# EAGLE design main_flight_computer (EAGLE 9.6.2)
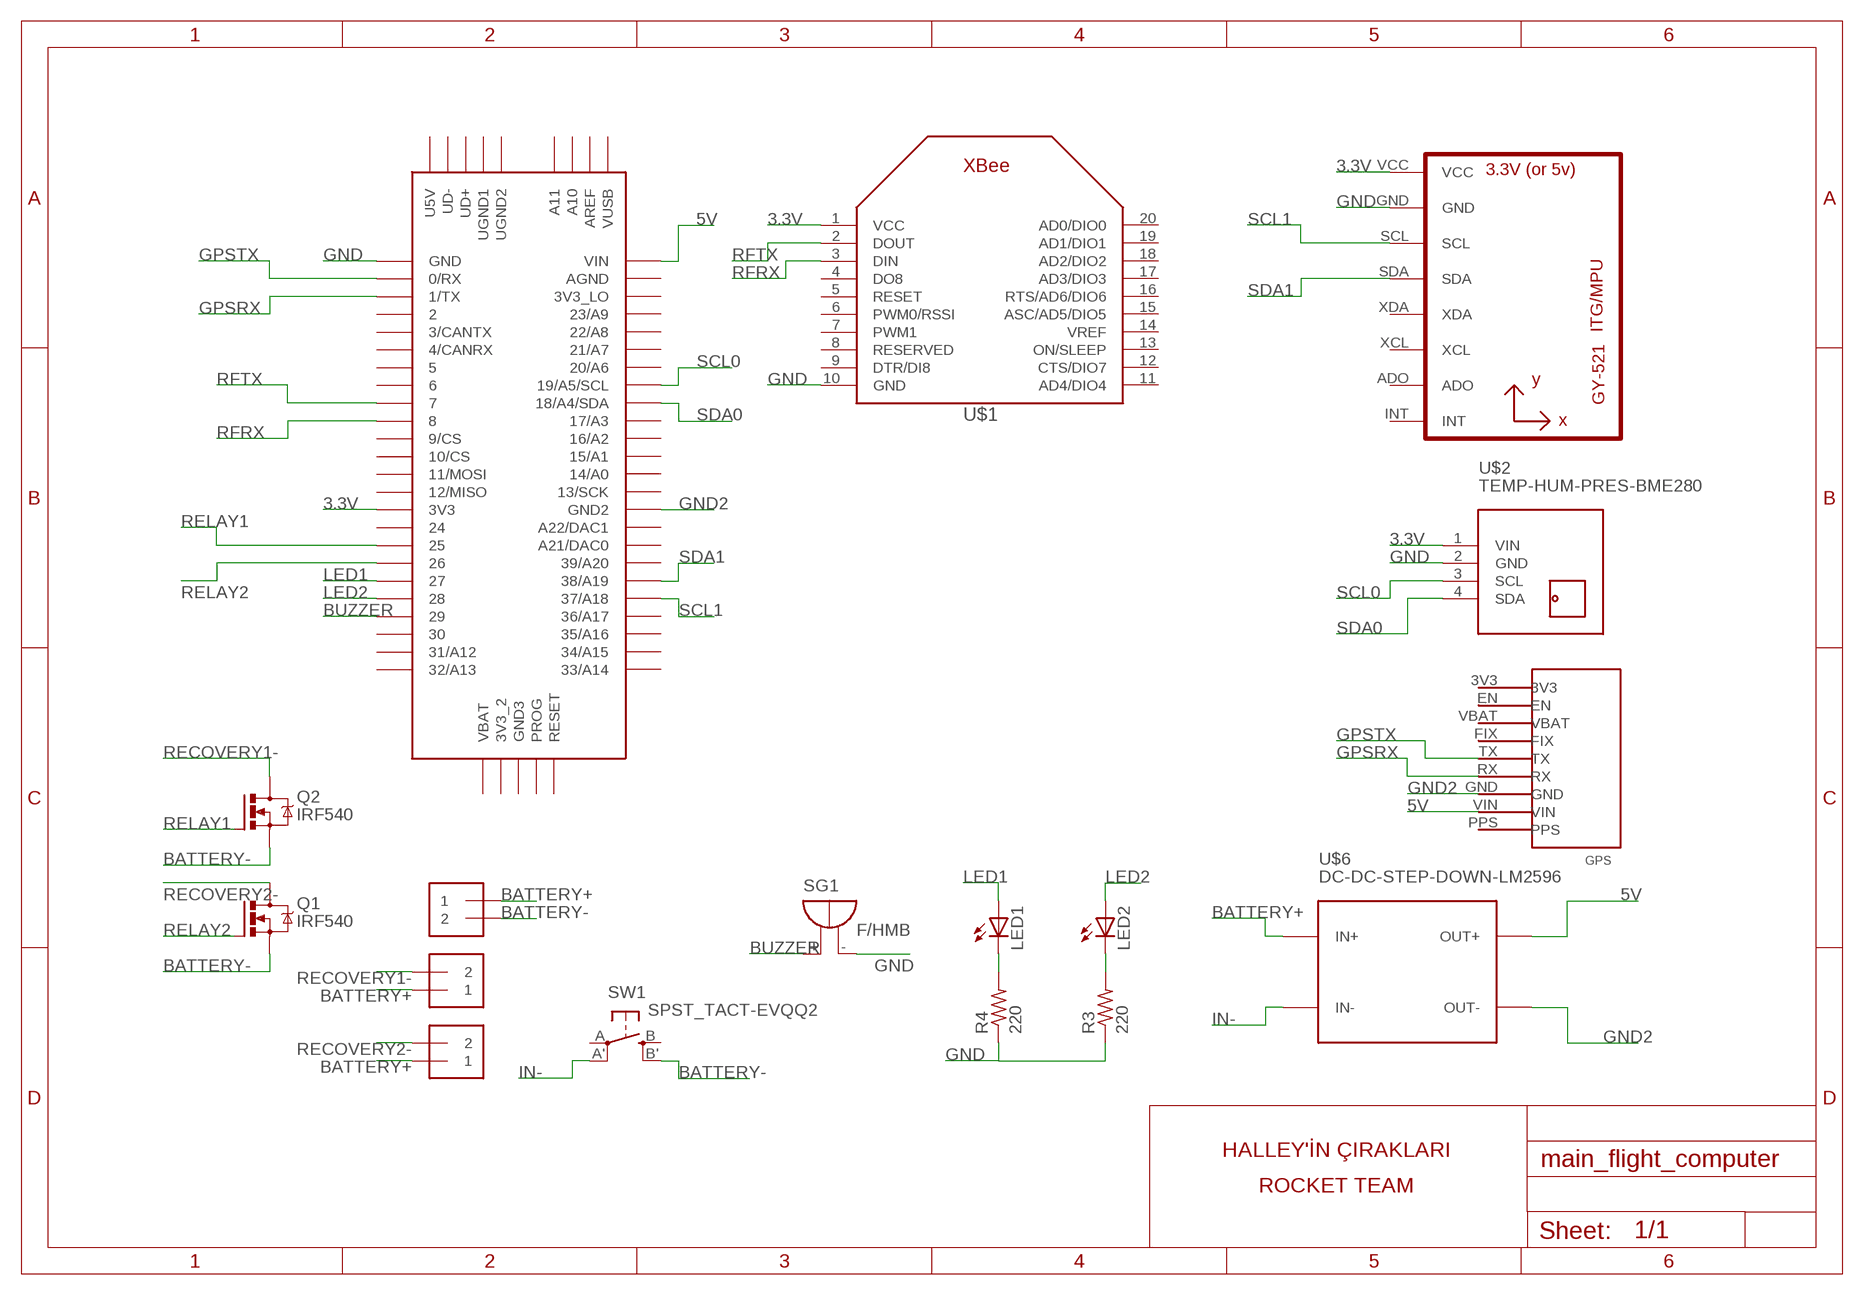
[diagram p0: schematic, sheet 1]

## Parts
J1  1X2-3.5MM  [1X2-3.5MM]
J2  1X2-3.5MM  [1X2-3.5MM]
J3  1X2-3.5MM  [1X2-3.5MM]
LED1  LED5MM  [LED5MM]
LED2  LED5MM  [LED5MM]
Q1  IRF540  NMOSFET_IRF540-TO220  [TO220BV]
Q2  IRF540  NMOSFET_IRF540-TO220  [TO220BV]
R3  220  R-US_0204/7  [0204/7]
R4  220  R-US_0204/7  [0204/7]
SG1  F/HMB  [F/HMB]
SW1  SPST_TACT-EVQQ2  [EVQ-Q2]
U1  GY-521MPU6050  [GY-521]
U$1  XBEE  [XBEE]
U$2  TEMP-HUM-PRES-BME280  [TEMP-HUM-PRES-BME280]
U$3  TEENSY_3.5/3.6  [TEENSY_3.5/3.6]
U$5  GPS  [GPS]
U$6  DC-DC-STEP-DOWN-LM2596  [DC-DC-STEP-DOWN-LM2596]

## Nets
3.3V: U1.VCC U$1.1(VCC) U$2.1(VIN) U$3.3V3
5V: U$3.VIN U$5.VIN U$6.OUT+
BATTERY+: J1.1 J2.1 J3.1 U$6.IN+
BATTERY-: J1.2 Q1.S Q2.S SW1.B'(S1)
BUZZER: SG1.+ U$3.29
GND: R3.1 R4.1 SG1.- U1.GND U$1.10(GND) U$2.2(GND) U$3.GND
GND2: U$3.GND2 U$5.GND U$6.OUT-
GPSRX: U$3.1/TX U$5.RX
GPSTX: U$3.0/RX U$5.TX
IN-: SW1.A'(P1) U$6.IN-
LED1: LED1.A U$3.27
LED2: LED2.A U$3.28
N$1: LED1.K(C) R4.2
N$2: LED2.K(C) R3.2
RECOVERY1-: J2.2 Q2.D
RECOVERY2-: J3.2 Q1.D
RELAY1: Q2.G U$3.25
RELAY2: Q1.G U$3.26
RFRX: U$1.3(DIN) U$3.8
RFTX: U$1.2(DOUT) U$3.7
SCL0: U$2.3(SCL) U$3.19/A5/SCL
SCL1: U1.SCL U$3.37/A18
SDA0: U$2.4(SDA) U$3.18/A4/SDA
SDA1: U1.SDA U$3.38/A19
Unconnected: SW1.A(P) SW1.B(S) U1.ADO U1.INT U1.XCL U1.XDA U$1.4(DO8) U$1.5(RESET) U$1.6(PWM0/RSSI) U$1.7(PWM1) U$1.8(RESERVED) U$1.9(DTR/DI8) U$1.11(AD4/DIO4) U$1.12(CTS/DIO7) U$1.13(ON/SLEEP) U$1.14(VREF) U$1.15(ASC/AD5/DIO5) U$1.16(RTS/AD6/DIO6) U$1.17(AD3/DIO3) U$1.18(AD2/DIO2) U$1.19(AD1/DIO1) U$1.20(AD0/DIO0) U$3.2 U$3.3/CANTX U$3.3V3_2 U$3.3V3_LO U$3.4/CANRX U$3.5 U$3.6 U$3.9/CS U$3.10/CS U$3.11/MOSI U$3.12/MISO U$3.13/SCK U$3.14/A0 U$3.15/A1 U$3.16/A2 U$3.17/A3 U$3.20/A6 U$3.21/A7 U$3.21/DAC0(A21/DAC0) U$3.22/A8 U$3.23/A9 U$3.24 U$3.30 U$3.31/A12 U$3.32/A13 U$3.33/A14 U$3.34/A15 U$3.35/A16 U$3.36/A17 U$3.39/A20 U$3.A10 U$3.A11 U$3.A22/DAC1 U$3.AGND U$3.AREF U$3.GND3 U$3.PROG U$3.RESET U$3.U5V U$3.UD+ U$3.UD- U$3.UGND1 U$3.UGND2 U$3.VBAT U$3.VUSB U$5.3V3 U$5.EN U$5.FIX U$5.PPS U$5.VBAT

## Notes on the sheet
- HALLEY'İN ÇIRAKLARI
- ROCKET TEAM

## Library data of the parts
J1-J3 = adafruit:1X2: 3.5mm Terminal block http://www.ladyada.net/library/pcb/eaglelibrary.html
LED1 LED2 = adafruit:LED: LED OSRAM: - CHIPLED LG R971, LG N971, LY N971, LG Q971, LY Q971, LO R971, LY R971 LH N974, LH R974 LS Q976, LO Q976, LY Q976 LO Q996 - Hyper CHIPLED LW Q18S LB Q993, LB Q99A, LB R99A - SideLED LS A670, LO A670, LY A670, LG A670, LP A670 LB A673, LV A673, LT A673, LW A673 LH A674 LY A675 LS A676, LA A676, LO A676, LY A676, LW A676 LS A679, LY A679, LG A679 - Hyper Micro SIDELED® LS Y876, LA Y876, LO Y876, LY Y876 LT Y87S - SmartLED LW L88C, LW L88S LB L89C, LB L89S, LG L890 LS L89K, LO L89K, LY L89K LS L896, LA L896, LO L896, LY L896 - TOPLED LS T670, LO T670, LY T670, LG T670, LP T670 LSG T670, LSP T670, LSY T670, LOP T670, LYG T670 LG T671, LOG T671, LSG T671 LB T673, LV T673, LT T673, LW T673 LH T674 LS T676, LA T676, LO T676, LY T676, LB T676, LH T676, LSB T676, LW T676 LB T67C, LV T67C, LT T67C, LS T67K, LO T67K, LY T67K, LW E67C LS E67B, LA E67B, LO E67B, LY E67B, LB E67C, LV E67C, LT E67C LW T67C LS T679, LY T679, LG T679 LS T770, LO T770, LY T770, LG T770, LP T770 LB T773, LV T773, LT T773, LW T773 LH T774 LS E675, LA E675, LY E675, LS T675 LS T776, LA T776, LO T776, LY T776, LB T776 LHGB T686 LT T68C, LB T68C - Hyper Mini TOPLED® LB M676 - Mini TOPLED Santana® LG M470 LS M47K, LO M47K, LY M47K Source: http://www.osram.convergy.de/
Q1 Q2 = Transistor:NMOSFET_: N-Channel MOSFET - Popular parts; CATEGORY: Transistor; DESCRIPTION: MOSFET N-CH 100V 33A TO-220AB; DRAIN_CURRENT: 33A; MANUFACTURER: Infineon Technologies; MPN: IRF540NPBF; OPERATING_TEMP: -55°C ~ 175°C; PART_STATUS: Active; ROHS_COMPLIANT: Yes; SUB-CATEGORY: MOSFET; THERMALLOSS: 130W; TYPE: N-Channel
R3 R4 = adafruit:R-US_: RESISTOR, American symbol
SG1 = buzzer:F/HMB: BUZZER Source: Buerklin; OC_FARNELL: unknown; OC_NEWARK: unknown
SW1 = adafruit:SPST_TACT: SMT 6mm switch, EVQQ2 series http://www.ladyada.net/library/eagle
U1 = gy-521:GY-521
U$1 = adafruit:XBEE
U$2 = diy-modules:TEMP-HUM-PRES-BME280: Digital Humidity-Temperature-Pressure Sensor based on BME280 device More information about BME280 device is available here: https://www.bosch-sensortec.com/bst/products/all_products/bme280 Click here to find device on ebay.com <http://www.ebay.com/sch/bme280+breakout>
U$3 = Teensy356:TEENSY_3.5/3.6
U$5 = Adafruit Ultimate GPS Breakout:GPS
U$6 = diy-modules:DC-DC-STEP-DOWN-LM2596: DC/DC Step-Down Regulator based on LM2596-ADJ chip LM2596 datasheet available here: http://www.ti.com/lit/ds/symlink/lm2596.pdf Click here to find device on ebay.com <http://www.ebay.com/sch/lm2596+power+regulator>

## Board
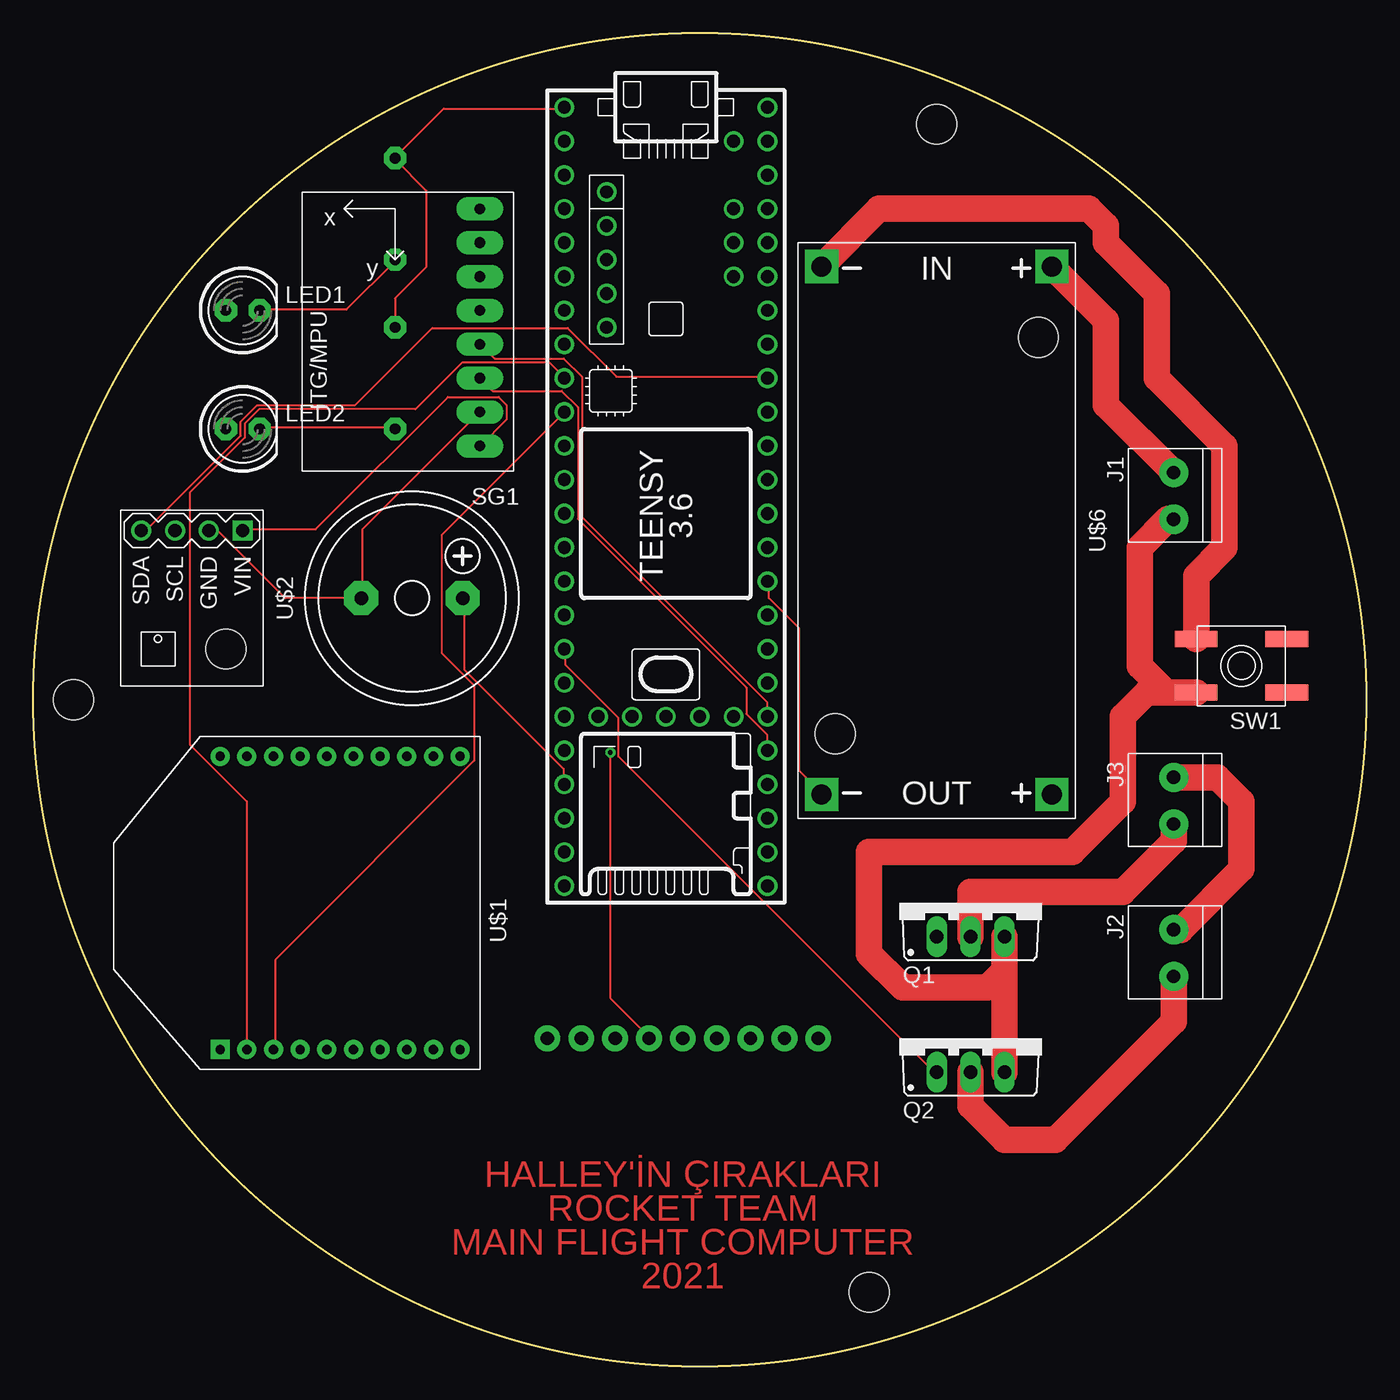
[diagram p1: board, top side]
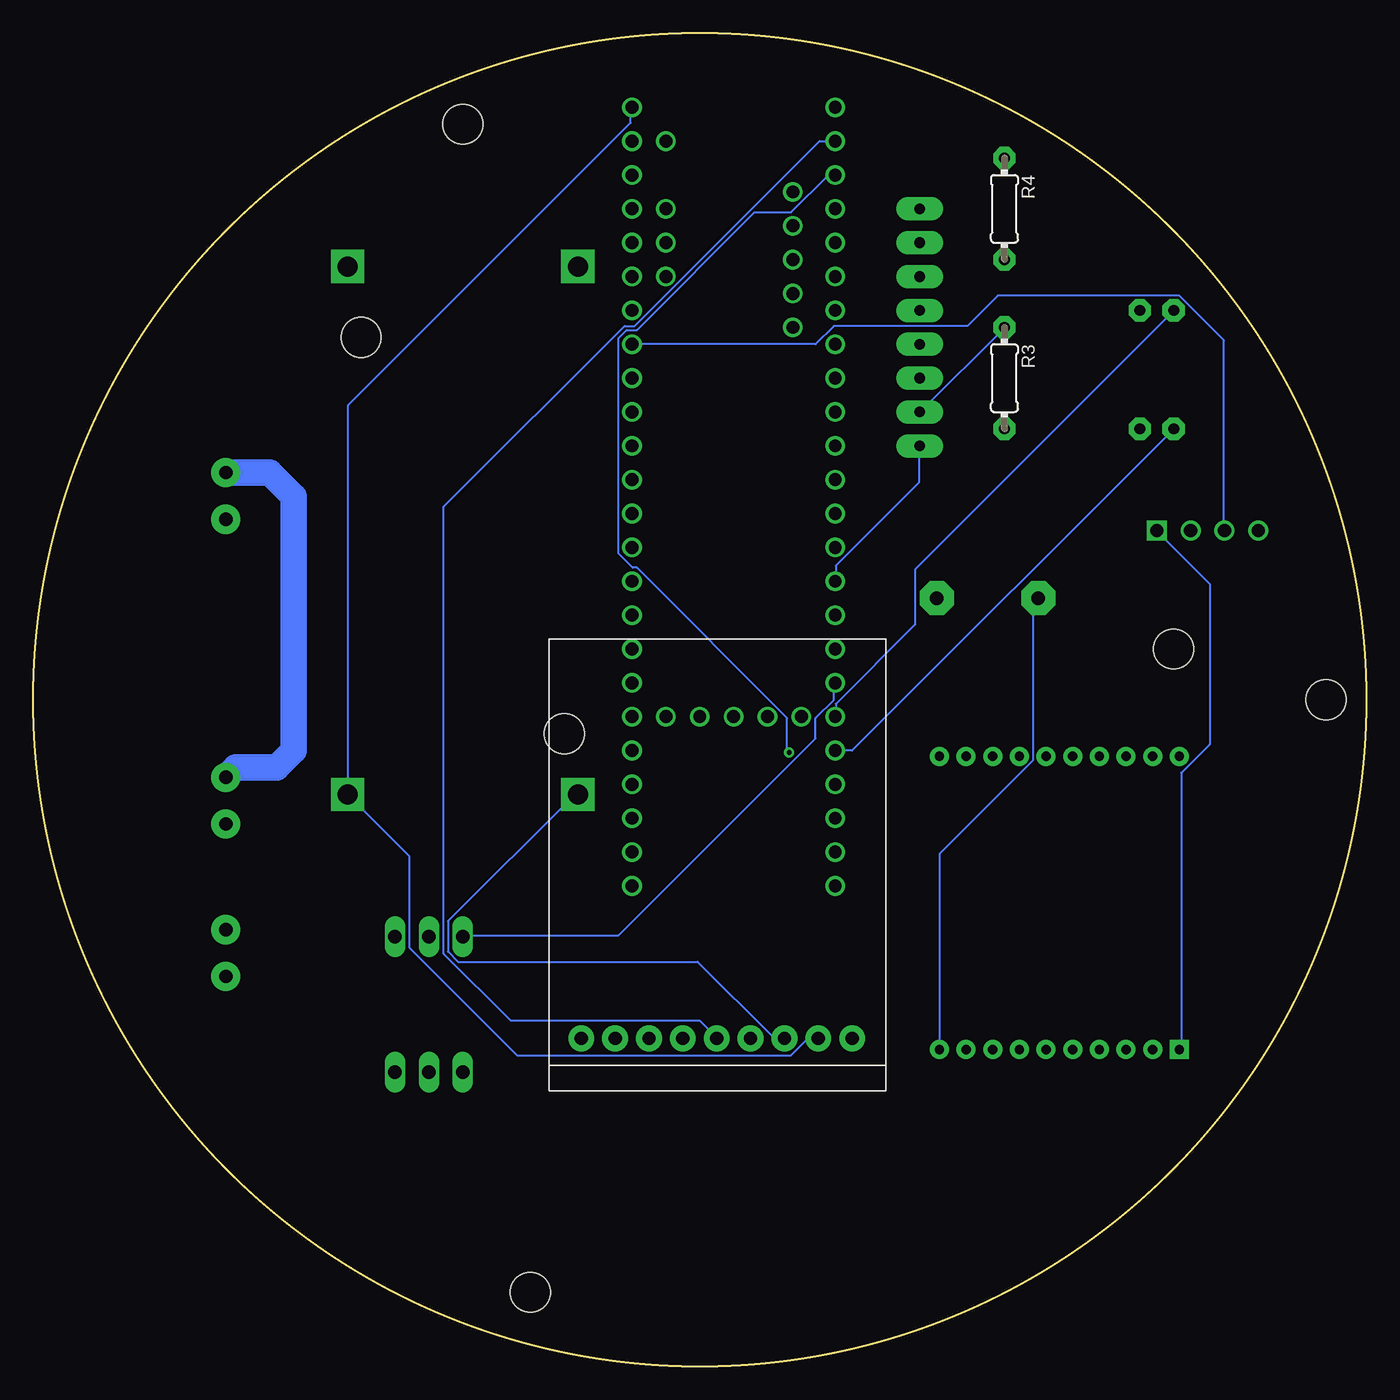
[diagram p2: board, bottom side, seen from below]

Size 100 x 100 mm. Coordinates in mm from the lower left corner, seen from the top.
Outline: circle at 50,50 radius 50
Copper layers (1*16): Top 0.035mm / dielectric 1.5mm / Bottom 0.035mm
Design rules "default": minimum track width 6mil, minimum drill 0.35mm, track to track 6mil, track to pad 6mil, pad to pad 6mil, via to via 6mil, smd to smd 6mil, copper to edge 40mil, drill to drill 6mil, minimum pad ring 10mil, minimum via ring 8mil, stop-mask expansion 4mil, vias tented up to drill 0mil, thermal gap 10mil
Holes 3 mm at 62.7,5.55 67.78,93.18 3.01,50

### Footprints (pad centres in the part's own frame; a part is rotated, then mirrored left to right if it is on the bottom)
1X2-3.5MM = drill 1 pad 2.184: 1 1.8,0; 2 -1.7,0
LED5MM = drill 0.813 pad 1.676 octagon: A -1.27,0; K 1.27,0
TO220BV = drill 1.016 long: D 0,-2.54; G -2.54,-2.54; S 2.54,-2.54
0204/7 = drill 0.813 pad 1.676 octagon: 1 -3.81,0; 2 3.81,0
F/HMB = drill 1.016 pad 2.54 octagon: + 3.81,0; - -3.81,0
EVQ-Q2 = smd 3.2 x 1.2: A -3.4,-2; A' 3.4,-2; B -3.4,2; B' 3.4,2
GY-521 = drill 0.8 pad 1.778 long: ADO -8.89,-6.35; GND -8.89,6.35; INT -8.89,-8.89; SCL -8.89,3.81; SDA -8.89,1.27; VCC -8.89,8.89; XCL -8.89,-3.81; XDA -8.89,-1.27
XBEE = drill 0.7 pad 1.422 square: 1 -11,5.5 | drill 0.7 pad 1.422: 2 -11,3.5; 3 -11,1.5; 4 -11,-0.5; 5 -11,-2.5; 6 -11,-4.5; 7 -11,-6.5; 8 -11,-8.5; 9 -11,-10.5; 10 -11,-12.5; 11 11,-12.5; 12 11,-10.5; 13 11,-8.5; 14 11,-6.5; 15 11,-4.5; 16 11,-2.5; 17 11,-0.5; 18 11,1.5; 19 11,3.5; 20 11,5.5
TEMP-HUM-PRES-BME280 = drill 1 square: 1 -5.08,3.81 | drill 1: 2 -5.08,1.27; 3 -5.08,-1.27; 4 -5.08,-3.81 | hole 3: 3.81,2.54
TEENSY_3.5/3.6 = drill 0.965: 0/RX -25.4,-7.62; 1/TX -22.86,-7.62; 2 -20.32,-7.62; 3/CANTX -17.78,-7.62; 3V3 7.62,-7.62; 3V3_2 17.78,-2.54; 3V3_LO -22.86,7.62; 4/CANRX -15.24,-7.62; 5 -12.7,-7.62; 6 -10.16,-7.62; 7 -7.62,-7.62; 8 -5.08,-7.62; 9/CS -2.54,-7.62; 10/CS 0,-7.62; 11/MOSI 2.54,-7.62; 12/MISO 5.08,-7.62; 13/SCK 5.08,7.62; 14/A0 2.54,7.62; 15/A1 0,7.62; 16/A2 -2.54,7.62; 17/A3 -5.08,7.62; 18/A4/SDA -7.62,7.62; 19/A5/SCL -10.16,7.62; 20/A6 -12.7,7.62; 21/A7 -15.24,7.62; 21/DAC0 12.7,7.62; 22/A8 -17.78,7.62; 23/A9 -20.32,7.62; 24 10.16,-7.62; 25 12.7,-7.62; 26 15.24,-7.62; 27 17.78,-7.62; 28 20.32,-7.62; 29 22.86,-7.62; 30 25.4,-7.62; 31/A12 27.94,-7.62; 32/A13 30.48,-7.62; 33/A14 30.48,7.62; 34/A15 27.94,7.62; 35/A16 25.4,7.62; 36/A17 22.86,7.62; 37/A18 20.32,7.62; 38/A19 17.78,7.62; 39/A20 15.24,7.62; A10 -17.78,5.08; A11 -15.24,5.08; A22/DAC1 10.16,7.62; AGND -25.4,7.62; AREF -20.32,5.08; GND -27.94,-7.62; GND2 7.62,7.62; GND3 17.78,0; PROG 17.78,2.54; RESET 17.78,5.08; U5V -21.59,-4.445; UD+ -16.51,-4.445; UD- -19.05,-4.445; UGND1 -13.97,-4.445; UGND2 -11.43,-4.445; VBAT 17.78,-5.08; VIN -27.94,7.62; VUSB -25.4,5.08
GPS = drill 1 pad 1.93: 3V3 -12.7,12.7; EN -12.7,10.16; FIX -12.7,5.08; GND -12.7,-2.54; PPS -12.7,-7.62; RX -12.7,0; TX -12.7,2.54; VBAT -12.7,7.62; VIN -12.7,-5.08
DC-DC-STEP-DOWN-LM2596 = drill 1.5 pad 2.5 square: IN+ -19.812,8.636; IN- -19.812,-8.636; OUT+ 19.812,8.636; OUT- 19.812,-8.636 | hole 3: -14.478,7.62; 15.24,-7.62

### Placement (x,y rotation side)
J1  85.56,65.24 90 top
J2  85.56,30.95 90 top
J3  85.56,42.38 90 top
LED1  15.71,79.21 0 top
LED2  15.71,70.32 0 top
Q1  70.32,34.76 0 top
Q2  70.32,24.6 0 top
R3  27.14,74.13 270 bottom
R4  27.14,86.83 270 bottom
SG1  28.41,57.62 0 top
SW1  90.64,52.54 180 top
U1  24.6,77.94 180 top
U$1  19.52,34.76 90 top
U$2  11.9,57.62 270 top
U$3  47.46,66.51 270 top
U$5  46.19,37.3 90 bottom
U$6  67.78,62.7 270 top

### Tracks (layer width: path | path; a pad name or v marks a point on that pad's centre or on a via)
3.3V
  Top 0.152: U1.VCC 33.54,69.05 35.52,71.03 35.52,72.1 34.91,72.71 31.1,72.71 21.2,62.8 15.71,62.8 U$2.1
  Bottom 0.152: U$3.3V3 39.79,58.99 39.79,60.06 33.54,66.31 33.54,69.05 U1.VCC | U$1.1 13.88,23.79 13.88,44.51 11.75,46.65 11.75,58.69 15.71,62.65 U$2.1
5V
  Bottom 0.152: U$3.VIN 55.18,94.35 55.18,93.28 76.36,72.1 76.36,42.99 U$6.OUT+ 71.79,38.27 71.79,31.41 63.72,23.33 43.14,23.33 41.92,24.55 41.16,24.55 U$5.VIN
BATTERY+
  Top 2: J2.1 86.09,32.75 90.64,37.3 90.64,42.38 88.84,44.18 J3.1 | J1.1 80.48,72.12 80.48,78.45 U$6.IN+
  Bottom 2: J3.1 84.82,44.92 81.75,44.92 80.48,46.19 80.48,65.24 82.28,67.04 J1.1
BATTERY-
  Top 2: 72.86,29.68 Q2.S | J1.2 85.13,63.54 83.02,61.43 83.02,52.54 85.02,50.54 SW1.B' 83.56,50.54 81.75,48.73 81.75,42.38 77.94,38.57 62.7,38.57 62.7,30.95 65.24,28.41 71.59,28.41 72.86,29.68 | Q1.S 72.86,29.68
BUZZER
  Top 0.152: U$3.29 39.79,43.75 39.79,44.82 32.32,52.29 32.32,57.62 SG1.+
GND
  Top 0.152: U$3.GND 39.79,94.35 30.8,94.35 27.14,90.69 R4.1 27.14,90.54 29.48,88.2 29.48,82.46 27.14,80.12 R3.1 | U$2.2 13.27,62.65 13.88,62.65 18.91,57.62 SG1.- 24.7,57.62 24.7,62.8 U1.GND
  Bottom 0.152: R3.1 27.14,77.89 33.39,71.64 U1.GND | U$1.10 32.02,23.79 32.02,38.42 25.01,45.43 25.01,57.31 24.7,57.62 SG1.-
GND2
  Top 0.152: U$3.GND2 55.18,58.84 55.18,57.62 57.47,55.33 57.47,44.67 59.14,42.99 U$6.OUT-
  Bottom 0.152: U$5.GND 43.75,24.7 44.51,24.7 50.15,30.34 68.14,30.34 68.9,31.1 68.9,33.39 59.45,42.84 59.14,42.84 U$6.OUT-
GPSRX  (via drill 0.35)
  Top 0.152: v43.29,46.04 43.29,27.6 46.19,24.7 U$5.RX
  Bottom 0.152: v43.29,46.04 43.45,46.19 43.45,48.63 54.72,59.91 55.03,59.91 56.1,60.97 56.1,77.13 55.49,77.74 54.72,77.74 45.88,86.58 43.14,86.58 40.4,89.32 39.94,89.32 U$3.1/TX
GPSTX
  Bottom 0.152: U$3.0/RX 41.01,91.91 54.88,78.04 55.64,78.04 69.2,64.48 69.2,30.95 64.17,25.92 50,25.92 48.78,24.7 U$5.TX
IN-
  Top 2: SW1.A' 87.24,59.3 89.37,61.43 89.37,69.05 84.29,74.13 84.29,80.48 80.48,84.29 80.48,85.56 79.21,86.83 63.46,86.83 U$6.IN-
LED1
  Bottom 0.152: U$3.27 39.79,48.78 39.79,49.7 33.85,55.64 33.85,59.75 14.49,79.11 LED1.A
LED2
  Bottom 0.152: U$3.28 38.57,46.19 LED2.A
N$1
  Top 0.152: LED1.K 17.08,79.26 23.48,79.26 27.14,82.92 R4.2
N$2
  Top 0.152: LED2.K 17.08,70.42 27.14,70.42 R3.2
RECOVERY1-
  Top 2: 70.32,20.79 Q2.D 70.32,19.52 72.86,16.98 76.67,16.98 85.56,25.87 J2.2
RECOVERY2-
  Top 2: Q1.D 70.32,35.6 81.75,35.6 85.56,39.41 J3.2
RELAY1
  Top 0.152: U$3.25 39.94,53.81 39.94,52.59 43.9,48.63 43.9,45.73 67.68,21.96 Q2.G
RELAY2
  Bottom 0.152: U$3.26 39.94,51.22 39.94,50 41.31,48.63 41.31,47.1 56.1,32.32 67.68,32.32 Q1.G
RFRX
  Top 0.152: U$1.3 18.15,23.79 18.15,30.49 33.08,45.43 33.08,51.07 30.64,53.5 30.64,62.34 39.79,71.49 U$3.8
RFTX
  Top 0.152: U$1.2 16.01,23.79 16.01,42.38 11.75,46.65 11.75,65.55 15.86,69.66 15.86,70.73 16.93,71.79 28.66,71.79 32.17,75.3 38.72,75.3 39.79,74.23 U$3.7
SCL0
  Bottom 0.152: U$3.19/A5/SCL 41.31,76.67 39.94,78.04 29.93,78.04 27.65,80.33 14.03,80.33 10.68,76.97 10.68,62.8 U$2.3
SCL1
  Top 0.152: U1.SCL 34.45,73.17 39.64,73.17 40.86,71.95 40.86,63.56 53.5,50.91 53.5,48.93 55.03,47.41 55.03,46.19 U$3.37/A18
SDA0
  Top 0.152: U$3.18/A4/SDA 55.03,74.23 43.75,74.23 40.09,77.89 29.93,77.89 24.14,72.1 16.78,72.1 15.56,70.88 15.56,69.81 8.55,62.8 8.09,62.8 U$2.4
SDA1
  Top 0.152: U$3.38/A19 55.03,48.78 55.03,49.85 41.16,63.72 41.16,74.23 39.79,75.6 34.61,75.6 33.54,76.67 U1.SDA

### Text on the board
Top: HALLEY'İN ÇIRAKLARI | ROCKET TEAM | MAIN FLIGHT COMPUTER | 2021